# Altium schematic sheet tia2.SchDoc: TIA 2
size A4; Author: Peilin Perry Xu; CompanyName: N/A; DrawnBy: Peilin Perry Xu; Engineer: Peilin Perry Xu; Organization: N/A; Address1: 89 Chestnut Street, Toronto, ON, Canada; Address2: 79 Brass Drive, Richmond Hill, ON, Canada; DocumentNumber: 2.2; Revision: 1; SheetNumber: 4; SheetTotal: 11
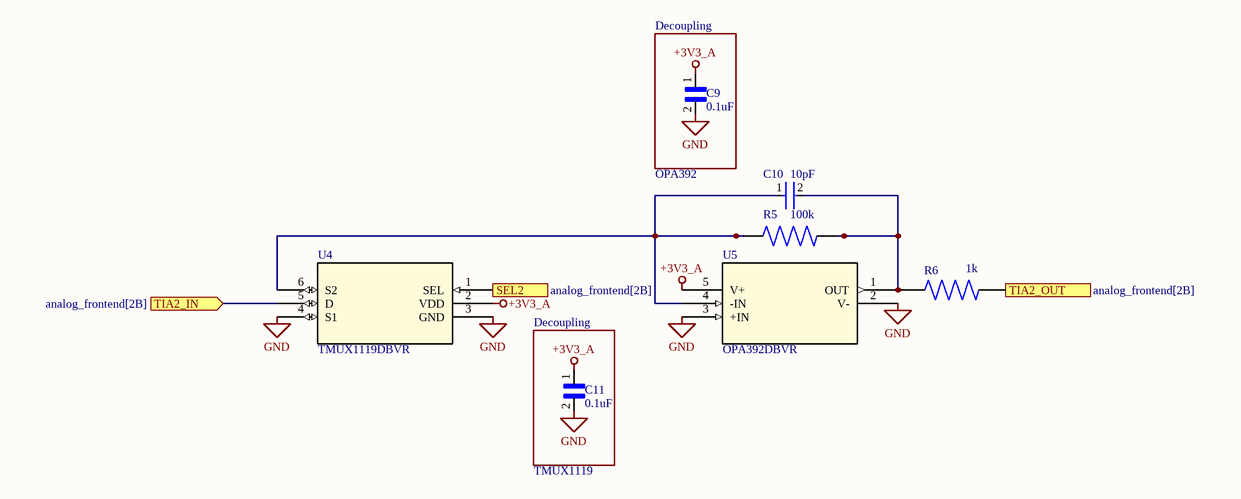
[diagram p0: tia2.SchDoc]

## Parts
C9  0.1uF  [CC0603JRX7R8BB104]
C10  10pF  [GCM1885C2A100JA16D]
C11  0.1uF  [CC0603JRX7R8BB104]
R5  100k  [RESC2012X55N]
R6  1k  [RESC1508X55N]
U4  TMUX1119DBVR  [TMUX1119DBVR]
U5  OPA392DBVR  [OPA392DBVR]

## Blocks framed on the sheet
Decoupling: C9
Decoupling: C11

## Ports
SEL2 (in, see analog_frontend[2B]), TIA2_IN (in, see analog_frontend[2B]), TIA2_OUT (out, see analog_frontend[2B])

## Nets
+3V3_A: C9.1 C11.1 U4.2(VDD) U5.5(V+)
GND: C9.2 C11.2 U4.3(GND) U4.4(S1) U5.2(V-) U5.3(+IN)
SEL2: U4.1(SEL) ; port SEL2
TIA2_IN: U4.5(D) ; port TIA2_IN
TIA2_OUT: R6.2 ; port TIA2_OUT
NetC10_1: C10.1 R5.1 U4.6(S2) U5.4(-IN)
NetC10_2: C10.2 R5.2 R6.1 U5.1(OUT)

## Notes on the sheet
- OPA392
- TMUX1119

## Library data of the parts
C9 C11 = CC0603JRX7R8BB104: 25V 100nF X7R ±5% 0603 Multilayer Ceramic Capacitors MLCC - SMD/SMT ROHS; Manufacturer: Yageo Group; Supplier: DigiKey; Supplier Part Number: 311-1777-1-ND; Manufacturer Part Number: CC0603JRX7R8BB104; RoHS: Compliant; Category: Ceramic Capacitors; Stock: 156739; Pricing: 1=0.1, 10=0.056, 50=0.0386, 100=0.0333, 500=0.02444, 1000=0.02172 (USD); Value: 100nF; Case/Package: 0603; Case Code (Imperial): 0603; Case Code (Metric): 1608; China RoHS: Compliant; Composition: Ceramic; Depth: 800µm; Dielectric: X7R; Dielectric Material: Ceramic; Halogen Free: Halogen Free; Height: 800µm; Lead Free: Lead Free; Length: 1.6mm; Lifecycle Status: Production; Max Operating Temperature: 125°C; Min Operating Temperature: -55°C; Mounting Technology: Surface Mount; Number of Terminals: 2; Radiation Hardening: No; REACH SVHC: Yes; Schedule B: 8532240020, 8532240020|8532240020, 8532240020|8532240020|8532240020, 8532240020|8532240020|8532240020|8532240020; Termination: SMD/SMT; Thickness: 889µm; Tolerance: 5%; Voltage Rating: 25V; Voltage Rating (DC): 25V; Weight: 2.012816mg; Width: 800µm; ComponentLink1URL: https://datasheet.octopart.com:443/CC0603JRX7R8BB104-Yageo-datasheet-177165144.pdf?src-supplier=IHS; ComponentLink1Description: https://datasheet.octopart.com:443/CC0603JRX7R8BB104-Yageo-datasheet-177165144.pdf?src-supplier=IHS; ComponentLink2URL: https://datasheet.octopart.com:443/CC0603JRX7R8BB104-Yageo-datasheet-147453679.pdf?src-supplier=Farnell; ComponentLink2Description: https://datasheet.octopart.com:443/CC0603JRX7R8BB104-Yageo-datasheet-147453679.pdf?src-supplier=Farnell; ComponentLink3URL: https://datasheet.octopart.com:443/CC0603JRX7R8BB104-Yageo-datasheet-181968346.pdf?src-supplier=Farnell; ComponentLink3Description: https://datasheet.octopart.com:443/CC0603JRX7R8BB104-Yageo-datasheet-181968346.pdf?src-supplier=Farnell; ComponentLink4URL: https://datasheet.octopart.com:443/CC0603JRX7R8BB104-Yageo-datasheet-151948686.pdf?src-supplier=TME; ComponentLink4Description: https://datasheet.octopart.com:443/CC0603JRX7R8BB104-Yageo-datasheet-151948686.pdf?src-supplier=TME; ComponentLink5URL: https://datasheet.octopart.com/CC0603JRX7R8BB104-Yageo-datasheet-12526321.pdf; ComponentLink5Description: https://datasheet.octopart.com/CC0603JRX7R8BB104-Yageo-datasheet-12526321.pdf; ComponentLink6URL: https://datasheet.octopart.com/CC0603JRX7R8BB104-Yageo-datasheet-10883670.pdf; ComponentLink6Description: https://datasheet.octopart.com/CC0603JRX7R8BB104-Yageo-datasheet-10883670.pdf; ComponentLink7URL: https://datasheet.octopart.com:443/CC0603JRX7R8BB104-Yageo-datasheet-166511530.pdf?src-supplier=Future+Electronics; ComponentLink7Description: https://datasheet.octopart.com:443/CC0603JRX7R8BB104-Yageo-datasheet-166511530.pdf?src-supplier=Future+Electronics; ComponentLink8URL: https://datasheet.octopart.com:443/CC0603JRX7R8BB104-Yageo-datasheet-137700082.pdf?src-supplier=Future+Electronics; ComponentLink8Description: https://datasheet.octopart.com:443/CC0603JRX7R8BB104-Yageo-datasheet-137700082.pdf?src-supplier=Future+Electronics; ComponentLink9URL: https://datasheet.octopart.com:443/CC0603JRX7R8BB104-Yageo-datasheet-137700084.pdf?src-supplier=Future+Electronics; ComponentLink9Description: https://datasheet.octopart.com:443/CC0603JRX7R8BB104-Yageo-datasheet-137700084.pdf?src-supplier=Future+Electronics; ComponentLink10URL: https://datasheet.octopart.com:443/CC0603JRX7R8BB104-Yageo-datasheet-27626582.pdf?src-supplier=Future+Electronics; ComponentLink10Description: https://datasheet.octopart.com:443/CC0603JRX7R8BB104-Yageo-datasheet-27626582.pdf?src-supplier=Future+Electronics; ComponentLink11URL: https://datasheet.octopart.com:443/CC0603JRX7R8BB104-Yageo-datasheet-15895757.pdf?src-supplier=Future+Electronics; ComponentLink11Description: https://datasheet.octopart.com:443/CC0603JRX7R8BB104-Yageo-datasheet-15895757.pdf?src-supplier=Future+Electronics; ComponentLink12URL: https://datasheet.octopart.com:443/CC0603JRX7R8BB104-Yageo-datasheet-10911834.pdf?src-supplier=Future+Electronics; ComponentLink12Description: https://datasheet.octopart.com:443/CC0603JRX7R8BB104-Yageo-datasheet-10911834.pdf?src-supplier=Future+Electronics; ComponentLink13URL: https://datasheet.octopart.com:443/CC0603JRX7R8BB104-Yageo-datasheet-8324442.pdf?src-supplier=Future+Electronics; ComponentLink13Description: https://datasheet.octopart.com:443/CC0603JRX7R8BB104-Yageo-datasheet-8324442.pdf?src-supplier=Future+Electronics; ComponentLink14URL: https://datasheet.octopart.com:443/CC0603JRX7R8BB104-Yageo-Group-datasheet-165992755.pdf?src-supplier=ODG+(Origin+Data+Global); ComponentLink14Description: https://datasheet.octopart.com:443/CC0603JRX7R8BB104-Yageo-Group-datasheet-165992755.pdf?src-supplier=ODG+(Origin+Data+Global); ComponentLink15URL: http://sigma.octopart.com:80/rohs_statement/Surface-Mount-Ceramic-Multilayer-Capacitors%3B-General-Purpose-%26-High-Capacitance-Class-2%2C-X7R-Yageo-family-124.pdf?src-supplier=Compliance+Statements; ComponentLink15Description: http://sigma.octopart.com:80/rohs_statement/Surface-Mount-Ceramic-Multilayer-Capacitors%3B-General-Purpose-%26-High-Capacitance-Class-2%2C-X7R-Yageo-family-124.pdf?src-supplier=Compliance+Statements; ComponentLink16URL: http://sigma.octopart.com:80/reach_statement/Surface-Mount-Ceramic-Multilayer-Capacitors%3B-General-Purpose-%26-High-Capacitance-Class-2%2C-X7R-Yageo-family-125.pdf?src-supplier=Compliance+Statements; ComponentLink16Description: http://sigma.octopart.com:80/reach_statement/Surface-Mount-Ceramic-Multilayer-Capacitors%3B-General-Purpose-%26-High-Capacitance-Class-2%2C-X7R-Yageo-family-125.pdf?src-supplier=Compliance+Statements; ComponentLink17URL: http://sigma.octopart.com:80/conflict_mineral_statement/Yageo-company-3.pdf?src-supplier=Compliance+Statements; ComponentLink17Description: http://sigma.octopart.com:80/conflict_mineral_statement/Yageo-company-3.pdf?src-supplier=Compliance+Statements; ComponentLink18URL: http://sigma.octopart.com:80/rohs_statement/Yageo-company-2.pdf?src-supplier=Compliance+Statements; ComponentLink18Description: http://sigma.octopart.com:80/rohs_statement/Yageo-company-2.pdf?src-supplier=Compliance+Statements; Supplier 1: DigiKey; Supplier Part Number 1: 311-1777-1-ND
C10 = GCM1885C2A100JA16D: 100V 10pF C0G ±5% 0603 Multilayer Ceramic Capacitors MLCC - SMD/SMT ROHS; Manufacturer: Murata; Manufacturer Lifecycle Status: IN PRODUCTION; Temperature Coefficient: 30ppm/°C; Supplier: DigiKey; Supplier Part Number: 490-4770-1-ND; Manufacturer Part Number: GCM1885C2A100JA16D; RoHS: Compliant; Category: Ceramic Capacitors; Stock: 71457; Pricing: 1=0.11, 10=0.059, 50=0.041, 100=0.0355, 500=0.02614, 1000=0.02328 (USD); Value: 10pF; Case/Package: 0603; Case Code (Imperial): 0603; Case Code (Metric): 1608; Depth: 800µm; Dielectric: C0G; Dielectric Material: Ceramic; Height: 800µm; Lead Free: Lead Free; Length: 1.6mm; Lifecycle Status: Production; Material: Ceramic; Max Operating Temperature: 125°C; Min Operating Temperature: -55°C; Mounting Technology: Surface Mount; Number of Terminals: 2; Radiation Hardening: No; Ratings: AEC-Q200; REACH SVHC: Yes; Schedule B: 8532240020, 8532240020|8532240020, 8532240020|8532240020|8532240020, 8532240020|8532240020|8532240020|8532240020; Termination: SMD/SMT; Tolerance: 5%; Voltage Rating: 100V; Voltage Rating (DC): 100V; Width: 800µm; ComponentLink1URL: https://datasheet.octopart.com:443/GCM1885C2A100JA16D-Murata-datasheet-149522596.pdf?src-supplier=element14+APAC; ComponentLink1Description: https://datasheet.octopart.com:443/GCM1885C2A100JA16D-Murata-datasheet-149522596.pdf?src-supplier=element14+APAC; ComponentLink2URL: https://datasheet.octopart.com:443/GCM1885C2A100JA16D-Murata-datasheet-141266547.pdf?src-supplier=Geoflip; ComponentLink2Description: https://datasheet.octopart.com:443/GCM1885C2A100JA16D-Murata-datasheet-141266547.pdf?src-supplier=Geoflip; ComponentLink3URL: https://datasheet.octopart.com:443/GCM1885C2A100JA16D-Murata-datasheet-14404396.pdf?src-supplier=Future+Electronics; ComponentLink3Description: https://datasheet.octopart.com:443/GCM1885C2A100JA16D-Murata-datasheet-14404396.pdf?src-supplier=Future+Electronics; ComponentLink4URL: https://datasheet.octopart.com:443/GCM1885C2A100JA16D-Murata-datasheet-44104434.pdf?src-supplier=Future+Electronics; ComponentLink4Description: https://datasheet.octopart.com:443/GCM1885C2A100JA16D-Murata-datasheet-44104434.pdf?src-supplier=Future+Electronics; ComponentLink5URL: https://datasheet.octopart.com:443/GCM1885C2A100JA16D-Murata-datasheet-140657391.pdf?src-supplier=Ciiva; ComponentLink5Description: https://datasheet.octopart.com:443/GCM1885C2A100JA16D-Murata-datasheet-140657391.pdf?src-supplier=Ciiva; ComponentLink6URL: https://datasheet.octopart.com:443/GCM1885C2A100JA16D-Murata-datasheet-138717048.pdf?src-supplier=Ciiva; ComponentLink6Description: https://datasheet.octopart.com:443/GCM1885C2A100JA16D-Murata-datasheet-138717048.pdf?src-supplier=Ciiva; ComponentLink7URL: https://datasheet.octopart.com:443/GCM1885C2A100JA16D-Murata-datasheet-150009059.pdf?src-supplier=Arrow.cn; ComponentLink7Description: https://datasheet.octopart.com:443/GCM1885C2A100JA16D-Murata-datasheet-150009059.pdf?src-supplier=Arrow.cn; ComponentLink8URL: https://datasheet.octopart.com:443/GCM1885C2A100JA16D-Murata-datasheet-11892650.pdf?src-supplier=Arrow+Electronics; ComponentLink8Description: https://datasheet.octopart.com:443/GCM1885C2A100JA16D-Murata-datasheet-11892650.pdf?src-supplier=Arrow+Electronics; ComponentLink9URL: https://datasheet.octopart.com:443/GCM1885C2A100JA16D-Murata-datasheet-12511495.pdf?src-supplier=TME; ComponentLink9Description: https://datasheet.octopart.com:443/GCM1885C2A100JA16D-Murata-datasheet-12511495.pdf?src-supplier=TME; ComponentLink10URL: http://sigma.octopart.com:80/reach_statement/Murata-company-16.pdf?src-supplier=Compliance+Statements; ComponentLink10Description: http://sigma.octopart.com:80/reach_statement/Murata-company-16.pdf?src-supplier=Compliance+Statements; Supplier 1: DigiKey; Supplier Part Number 1: 490-4770-1-ND
R5 = TNPW0805100KBXEN: Fixed Resistor, Thin Film, 0.125W, 100000ohm, 150V, 0.1% +/-Tol, 15ppm/Cel, Surface Mount, 0805; Manufacturer: Vishay; Power Dissipation: 125mW; Value: 100kΩ; Temperature Coefficient: 15ppm/°C; Supplier: DigiKey; Supplier Part Number: 541-1729-1-ND; Manufacturer Part Number: TNPW0805100KBXEN; RoHS: Compliant; Category: Chip SMD Resistors; Stock: 958; Pricing: 1=0.56, 10=0.462, 25=0.4284, 50=0.4048, 100=0.383, 250=0.35688, 500=0.33922 (USD); Case/Package: 0805; Case Code (Imperial): 0805; Case Code (Metric): 2012; China RoHS: Compliant; Composition: Thin Film; Depth: 1.25mm; Height: 450µm; Length: 2.0066mm; Lifecycle Status: Production; Max Operating Temperature: 125°C; Military Standard: Not; Min Operating Temperature: -55°C; Mounting Technology: Surface Mount; Number of Terminals: 2; Packaging: Digi-Reel®; Power Rating: 125mW; REACH SVHC: Yes; Schedule B: 8533210045, 8533210045|8533210045|8533210045|8533210045|8533210045; Tolerance: 0.1%; Width: 1.25mm; Working Voltage: 150V; ComponentLink1URL: https://datasheet.octopart.com:443/TNPW0805100KBXEN-Vishay-datasheet-170520403.pdf?src-supplier=IHS; ComponentLink1Description: https://datasheet.octopart.com:443/TNPW0805100KBXEN-Vishay-datasheet-170520403.pdf?src-supplier=IHS; ComponentLink2URL: https://datasheet.octopart.com:443/TNPW0805100KBXEN-Vishay-Dale-datasheet-182026744.pdf?src-supplier=IHS; ComponentLink2Description: https://datasheet.octopart.com:443/TNPW0805100KBXEN-Vishay-Dale-datasheet-182026744.pdf?src-supplier=IHS; ComponentLink3URL: https://datasheet.octopart.com/TNPW0805100KBXEN-Vishay-datasheet-13498837.pdf; ComponentLink3Description: https://datasheet.octopart.com/TNPW0805100KBXEN-Vishay-datasheet-13498837.pdf; ComponentLink4URL: https://datasheet.octopart.com/TNPW0805100KBXEN-Vishay-datasheet-13414878.pdf; ComponentLink4Description: https://datasheet.octopart.com/TNPW0805100KBXEN-Vishay-datasheet-13414878.pdf; ComponentLink5URL: https://datasheet.octopart.com/TNPW0805100KBXEN-Vishay-datasheet-13295955.pdf; ComponentLink5Description: https://datasheet.octopart.com/TNPW0805100KBXEN-Vishay-datasheet-13295955.pdf; ComponentLink6URL: https://datasheet.octopart.com/TNPW0805100KBXEN-Vishay-datasheet-13196373.pdf; ComponentLink6Description: https://datasheet.octopart.com/TNPW0805100KBXEN-Vishay-datasheet-13196373.pdf; ComponentLink7URL: https://datasheet.octopart.com/TNPW0805100KBXEN-Vishay-datasheet-13143890.pdf; ComponentLink7Description: https://datasheet.octopart.com/TNPW0805100KBXEN-Vishay-datasheet-13143890.pdf; ComponentLink8URL: https://datasheet.octopart.com/TNPW0805100KBXEN-Vishay-datasheet-13081780.pdf; ComponentLink8Description: https://datasheet.octopart.com/TNPW0805100KBXEN-Vishay-datasheet-13081780.pdf; ComponentLink9URL: https://datasheet.octopart.com/TNPW0805100KBXEN-Vishay-datasheet-13052401.pdf; ComponentLink9Description: https://datasheet.octopart.com/TNPW0805100KBXEN-Vishay-datasheet-13052401.pdf; ComponentLink10URL: https://datasheet.octopart.com/TNPW0805100KBXEN-Vishay-datasheet-13034137.pdf; ComponentLink10Description: https://datasheet.octopart.com/TNPW0805100KBXEN-Vishay-datasheet-13034137.pdf; ComponentLink11URL: https://datasheet.octopart.com/TNPW0805100KBXEN-Vishay-datasheet-12585086.pdf; ComponentLink11Description: https://datasheet.octopart.com/TNPW0805100KBXEN-Vishay-datasheet-12585086.pdf; ComponentLink12URL: https://datasheet.octopart.com/TNPW0805100KBXEN-Vishay-datasheet-12543131.pdf; ComponentLink12Description: https://datasheet.octopart.com/TNPW0805100KBXEN-Vishay-datasheet-12543131.pdf; ComponentLink13URL: https://datasheet.octopart.com/TNPW0805100KBXEN-Vishay-datasheet-12532511.pdf; ComponentLink13Description: https://datasheet.octopart.com/TNPW0805100KBXEN-Vishay-datasheet-12532511.pdf; ComponentLink14URL: https://datasheet.octopart.com/TNPW0805100KBXEN-Vishay-datasheet-12519971.pdf; ComponentLink14Description: https://datasheet.octopart.com/TNPW0805100KBXEN-Vishay-datasheet-12519971.pdf; ComponentLink15URL: https://datasheet.octopart.com/TNPW0805100KBXEN-Vishay-datasheet-12509767.pdf; ComponentLink15Description: https://datasheet.octopart.com/TNPW0805100KBXEN-Vishay-datasheet-12509767.pdf; ComponentLink16URL: https://datasheet.octopart.com/TNPW0805100KBXEN-Vishay-datasheet-12365287.pdf; ComponentLink16Description: https://datasheet.octopart.com/TNPW0805100KBXEN-Vishay-datasheet-12365287.pdf; ComponentLink17URL: https://datasheet.octopart.com/TNPW0805100KBXEN-Vishay-datasheet-10854096.pdf; ComponentLink17Description: https://datasheet.octopart.com/TNPW0805100KBXEN-Vishay-datasheet-10854096.pdf; ComponentLink18URL: https://datasheet.octopart.com/TNPW0805100KBXEN-Vishay-datasheet-10678752.pdf; ComponentLink18Description: https://datasheet.octopart.com/TNPW0805100KBXEN-Vishay-datasheet-10678752.pdf; ComponentLink19URL: https://datasheet.octopart.com/TNPW0805100KBXEN-Vishay-datasheet-10283461.pdf; ComponentLink19Description: https://datasheet.octopart.com/TNPW0805100KBXEN-Vishay-datasheet-10283461.pdf; ComponentLink20URL: https://datasheet.octopart.com/TNPW0805100KBXEN-Vishay-datasheet-10185418.pdf; ComponentLink20Description: https://datasheet.octopart.com/TNPW0805100KBXEN-Vishay-datasheet-10185418.pdf; ComponentLink21URL: https://datasheet.octopart.com/TNPW0805100KBXEN-Vishay-datasheet-10055244.pdf; ComponentLink21Description: https://datasheet.octopart.com/TNPW0805100KBXEN-Vishay-datasheet-10055244.pdf; ComponentLink22URL: http://sigma.octopart.com:80/rohs_statement/Vishay-company-15.pdf?src-supplier=Compliance+Statements; ComponentLink22Description: http://sigma.octopart.com:80/rohs_statement/Vishay-company-15.pdf?src-supplier=Compliance+Statements; Supplier 1: DigiKey; Supplier Part Number 1: 541-1729-1-ND; Export Control Classification Number (ECCN) Code: EAR99; Harmonized Tariff Schedule (HTS) Code: 8533.21.00.30; Number of Terminations: 2; Contact Plating: Tin; Features: Anti-Sulfur, Automotive AEC-Q200, Moisture Resistant; Max Power Dissipation: 125mW; Radiation Hardening: No
R6 = TNPW06031K00BXEN: Fixed Resistor, Thin Film, 0.1W, 1000ohm, 75V, 0.1% +/-Tol, 15ppm/Cel, Surface Mount, 0603; Manufacturer: Vishay; Max Power Dissipation: 100mW; Value: 1kΩ; Temperature Coefficient: 15ppm/°C; Supplier: DigiKey; Supplier Part Number: 541-1724-1-ND; Manufacturer Part Number: TNPW06031K00BXEN; RoHS: Compliant; Category: Chip SMD Resistors; Stock: 1829; Pricing: 1=0.66, 10=0.548, 25=0.5076, 50=0.4798, 100=0.454, 250=0.42332, 500=0.40256 (USD); Case/Package: 0603; Case Code (Imperial): 0603; Case Code (Metric): 1608; China RoHS: Compliant; Composition: Thin Film; Contact Plating: Tin; Country of Origin: Germany, Israel; Depth: 850µm; Export Control Classification Number (ECCN) Code: EAR99; Features: Anti-Sulfur, Automotive AEC-Q200, Moisture Resistant; Height: 450µm; Harmonized Tariff Schedule (HTS) Code: 8533.21.00.30; Introduction Date: 2008-07-30; Length: 1.6002mm; Lifecycle Status: Production; Max Operating Temperature: 125°C; Military Standard: Not; Min Operating Temperature: -55°C; Mounting Technology: Surface Mount; Number of Terminals: 2; Number of Terminations: 2; Packaging: Digi-Reel®; Power Dissipation: 100mW; Power Rating: 100mW; Radiation Hardening: No; REACH SVHC: Yes; Schedule B: 8533210045, 8533210045|8533210045|8533210045|8533210045|8533210045|8533210045|8533210045|8533210045|8533210045|8533210045|8533210045|8533210045|8533210045|8533210045|8533210045|8533210045|8533210045|8533210045|8533210045|8533210045|8533210045|8533210045|8533210045|85; Tolerance: 0.1%; Width: 850µm; Working Voltage: 75V; ComponentLink1URL: https://datasheet.octopart.com:443/TNPW06031K00BXEN-Vishay-datasheet-170520403.pdf?src-supplier=IHS; ComponentLink1Description: https://datasheet.octopart.com:443/TNPW06031K00BXEN-Vishay-datasheet-170520403.pdf?src-supplier=IHS; ComponentLink2URL: https://datasheet.octopart.com:443/TNPW06031K00BXEN-Vishay-Dale-datasheet-182026744.pdf?src-supplier=IHS; ComponentLink2Description: https://datasheet.octopart.com:443/TNPW06031K00BXEN-Vishay-Dale-datasheet-182026744.pdf?src-supplier=IHS; ComponentLink3URL: https://datasheet.octopart.com:443/TNPW06031K00BXEN-Vishay-datasheet-79783896.pdf?src-supplier=Future+Electronics; ComponentLink3Description: https://datasheet.octopart.com:443/TNPW06031K00BXEN-Vishay-datasheet-79783896.pdf?src-supplier=Future+Electronics; ComponentLink4URL: https://datasheet.octopart.com/TNPW06031K00BXEN-Vishay-datasheet-13498837.pdf; ComponentLink4Description: https://datasheet.octopart.com/TNPW06031K00BXEN-Vishay-datasheet-13498837.pdf; ComponentLink5URL: https://datasheet.octopart.com/TNPW06031K00BXEN-Vishay-datasheet-13414878.pdf; ComponentLink5Description: https://datasheet.octopart.com/TNPW06031K00BXEN-Vishay-datasheet-13414878.pdf; ComponentLink6URL: https://datasheet.octopart.com/TNPW06031K00BXEN-Vishay-datasheet-13295955.pdf; ComponentLink6Description: https://datasheet.octopart.com/TNPW06031K00BXEN-Vishay-datasheet-13295955.pdf; ComponentLink7URL: https://datasheet.octopart.com/TNPW06031K00BXEN-Vishay-datasheet-13196373.pdf; ComponentLink7Description: https://datasheet.octopart.com/TNPW06031K00BXEN-Vishay-datasheet-13196373.pdf; ComponentLink8URL: https://datasheet.octopart.com/TNPW06031K00BXEN-Vishay-datasheet-13143890.pdf; ComponentLink8Description: https://datasheet.octopart.com/TNPW06031K00BXEN-Vishay-datasheet-13143890.pdf; ComponentLink9URL: https://datasheet.octopart.com/TNPW06031K00BXEN-Vishay-datasheet-13081780.pdf; ComponentLink9Description: https://datasheet.octopart.com/TNPW06031K00BXEN-Vishay-datasheet-13081780.pdf; ComponentLink10URL: https://datasheet.octopart.com/TNPW06031K00BXEN-Vishay-datasheet-13052401.pdf; ComponentLink10Description: https://datasheet.octopart.com/TNPW06031K00BXEN-Vishay-datasheet-13052401.pdf; ComponentLink11URL: https://datasheet.octopart.com/TNPW06031K00BXEN-Vishay-datasheet-13034137.pdf; ComponentLink11Description: https://datasheet.octopart.com/TNPW06031K00BXEN-Vishay-datasheet-13034137.pdf; ComponentLink12URL: https://datasheet.octopart.com/TNPW06031K00BXEN-Vishay-datasheet-12585086.pdf; ComponentLink12Description: https://datasheet.octopart.com/TNPW06031K00BXEN-Vishay-datasheet-12585086.pdf; ComponentLink13URL: https://datasheet.octopart.com/TNPW06031K00BXEN-Vishay-datasheet-12543131.pdf; ComponentLink13Description: https://datasheet.octopart.com/TNPW06031K00BXEN-Vishay-datasheet-12543131.pdf; ComponentLink14URL: https://datasheet.octopart.com/TNPW06031K00BXEN-Vishay-datasheet-12532511.pdf; ComponentLink14Description: https://datasheet.octopart.com/TNPW06031K00BXEN-Vishay-datasheet-12532511.pdf; ComponentLink15URL: https://datasheet.octopart.com/TNPW06031K00BXEN-Vishay-datasheet-12519971.pdf; ComponentLink15Description: https://datasheet.octopart.com/TNPW06031K00BXEN-Vishay-datasheet-12519971.pdf; ComponentLink16URL: https://datasheet.octopart.com/TNPW06031K00BXEN-Vishay-datasheet-12509767.pdf; ComponentLink16Description: https://datasheet.octopart.com/TNPW06031K00BXEN-Vishay-datasheet-12509767.pdf; ComponentLink17URL: https://datasheet.octopart.com/TNPW06031K00BXEN-Vishay-datasheet-12365287.pdf; ComponentLink17Description: https://datasheet.octopart.com/TNPW06031K00BXEN-Vishay-datasheet-12365287.pdf; ComponentLink18URL: https://datasheet.octopart.com/TNPW06031K00BXEN-Vishay-datasheet-10854096.pdf; ComponentLink18Description: https://datasheet.octopart.com/TNPW06031K00BXEN-Vishay-datasheet-10854096.pdf; ComponentLink19URL: https://datasheet.octopart.com/TNPW06031K00BXEN-Vishay-datasheet-10678752.pdf; ComponentLink19Description: https://datasheet.octopart.com/TNPW06031K00BXEN-Vishay-datasheet-10678752.pdf; ComponentLink20URL: https://datasheet.octopart.com/TNPW06031K00BXEN-Vishay-datasheet-10283461.pdf; ComponentLink20Description: https://datasheet.octopart.com/TNPW06031K00BXEN-Vishay-datasheet-10283461.pdf; ComponentLink21URL: https://datasheet.octopart.com/TNPW06031K00BXEN-Vishay-datasheet-10185418.pdf; ComponentLink21Description: https://datasheet.octopart.com/TNPW06031K00BXEN-Vishay-datasheet-10185418.pdf; ComponentLink22URL: https://datasheet.octopart.com/TNPW06031K00BXEN-Vishay-datasheet-10055244.pdf; ComponentLink22Description: https://datasheet.octopart.com/TNPW06031K00BXEN-Vishay-datasheet-10055244.pdf; ComponentLink23URL: http://sigma.octopart.com:80/rohs_statement/Vishay-company-15.pdf?src-supplier=Compliance+Statements; ComponentLink23Description: http://sigma.octopart.com:80/rohs_statement/Vishay-company-15.pdf?src-supplier=Compliance+Statements; Supplier 1: DigiKey; Supplier Part Number 1: 541-1724-1-ND
U4 = TMUX1119DBVR: 3-pA on-state leakage current, 5-V, 2: 1 (SPDT), 1-channel precision multiplexer 6-SOT-23 -40 to 125; Manufacturer: Texas Instruments; Manufacturer Lifecycle Status: ACTIVE; Supplier: DigiKey; Supplier Part Number: 296-TMUX1119DBVRCT-ND; Manufacturer Part Number: TMUX1119DBVR; RoHS: Compliant; Category: Analog Switches and Multiplexers; Stock: 2894; Pricing: 1=2.28, 10=1.689, 25=1.5416, 100=1.3792, 250=1.30176, 500=1.2551, 1000=1.2167 (USD); Case/Package: SOT-23; Height: 0m; Length: 2.9mm; Lifecycle Status: Production; Pins: 6; Thickness: 1.2mm; Width: 1.6mm; ComponentLink1URL: https://sigma.octopart.com:443/182282880/technical_drawing/Texas-Instruments-TMUX1119DBVR.pdf?src-supplier=Texas+Instruments; ComponentLink1Description: https://sigma.octopart.com:443/182282880/technical_drawing/Texas-Instruments-TMUX1119DBVR.pdf?src-supplier=Texas+Instruments; ComponentLink2URL: https://octopart.com:443/opatz8j6/c1?t=yECAgEkYw3IrtmcYAPUg6qmtTNVur26oqu7bOUHrX4PjdCuRILzYU7NYBAOQhcHCEh7pGXbbhV7dRzS-y_krheoFYbJWFRUJnbuv9i6p_6F7rsSszCR-29LbgFxprD0A_1YADurANESAiN07S0sT7RtN2jCeaOp3CvIUB0Bo5PdEeow8fbFIgGzo96oF51yr-ojeUHaJ1WufcKjvz0ps8WKzjIL6purfuRAG7xH0VGn1P7ZxlGQD0tIKLS8oKKYj-Fz5Ea2n9r1HKmhlaJ4GaZS8DSK0gFGX7s4AbnVilZHcfV3fVg9sV4wtLmOQXeutcERFFUScrNyKsjhbrfqGSuNTPgKcDcwJj1v-ecbxAxlVkBgbaKyAS0oepKB46l8Mr7K_1Qkg&src-supplier=Texas+Instruments; ComponentLink2Description: https://octopart.com:443/opatz8j6/c1?t=yECAgEkYw3IrtmcYAPUg6qmtTNVur26oqu7bOUHrX4PjdCuRILzYU7NYBAOQhcHCEh7pGXbbhV7dRzS-y_krheoFYbJWFRUJnbuv9i6p_6F7rsSszCR-29LbgFxprD0A_1YADurANESAiN07S0sT7RtN2jCeaOp3CvIUB0Bo5PdEeow8fbFIgGzo96oF51yr-ojeUHaJ1WufcKjvz0ps8WKzjIL6purfuRAG7xH0VGn1P7ZxlGQD0tIKLS8oKKYj-Fz5Ea2n9r1HKmhlaJ4GaZS8DSK0gFGX7s4AbnVilZHcfV3fVg9sV4wtLmOQXeutcERFFUScrNyKsjhbrfqGSuNTPgKcDcwJj1v-ecbxAxlVkBgbaKyAS0oepKB46l8Mr7K_1Qkg&src-supplier=Texas+Instruments; ComponentLink3URL: https://sigma.octopart.com:443/179253514/technical_drawing/Texas-Instruments-TMUX1119DBVR.pdf?src-supplier=Texas+Instruments; ComponentLink3Description: https://sigma.octopart.com:443/179253514/technical_drawing/Texas-Instruments-TMUX1119DBVR.pdf?src-supplier=Texas+Instruments; ComponentLink4URL: https://sigma.octopart.com:443/177332312/technical_drawing/Texas-Instruments-TMUX1119DBVR.pdf?src-supplier=Texas+Instruments; ComponentLink4Description: https://sigma.octopart.com:443/177332312/technical_drawing/Texas-Instruments-TMUX1119DBVR.pdf?src-supplier=Texas+Instruments; ComponentLink5URL: https://sigma.octopart.com:443/175570407/technical_drawing/Texas-Instruments-TMUX1119DBVR.pdf?src-supplier=Texas+Instruments; ComponentLink5Description: https://sigma.octopart.com:443/175570407/technical_drawing/Texas-Instruments-TMUX1119DBVR.pdf?src-supplier=Texas+Instruments; ComponentLink6URL: https://sigma.octopart.com:443/154719501/technical_drawing/Texas-Instruments-TMUX1119DBVR.pdf?src-supplier=Texas+Instruments; ComponentLink6Description: https://sigma.octopart.com:443/154719501/technical_drawing/Texas-Instruments-TMUX1119DBVR.pdf?src-supplier=Texas+Instruments; ComponentLink7URL: https://sigma.octopart.com:443/49249327/technical_drawing/Texas-Instruments-TMUX1119DBVR.pdf?src-supplier=Texas+Instruments; ComponentLink7Description: https://sigma.octopart.com:443/49249327/technical_drawing/Texas-Instruments-TMUX1119DBVR.pdf?src-supplier=Texas+Instruments; ComponentLink8URL: https://datasheet.octopart.com:443/TMUX1119DBVR-Texas-Instruments-datasheet-179666360.pdf?src-supplier=EBEE; ComponentLink8Description: https://datasheet.octopart.com:443/TMUX1119DBVR-Texas-Instruments-datasheet-179666360.pdf?src-supplier=EBEE; ComponentLink9URL: https://datasheet.octopart.com:443/TMUX1119DBVR-Texas-Instruments-datasheet-164419629.pdf?src-supplier=Augswan; ComponentLink9Description: https://datasheet.octopart.com:443/TMUX1119DBVR-Texas-Instruments-datasheet-164419629.pdf?src-supplier=Augswan; ComponentLink10URL: http://sigma.octopart.com:80/reach_statement/Texas-Instruments-company-64.pdf?src-supplier=Compliance+Statements; ComponentLink10Description: http://sigma.octopart.com:80/reach_statement/Texas-Instruments-company-64.pdf?src-supplier=Compliance+Statements; ComponentLink11URL: http://sigma.octopart.com:80/conflict_mineral_statement/Texas-Instruments-company-63.pdf?src-supplier=Compliance+Statements; ComponentLink11Description: http://sigma.octopart.com:80/conflict_mineral_statement/Texas-Instruments-company-63.pdf?src-supplier=Compliance+Statements; Supplier 1: DigiKey; Supplier Part Number 1: 296-TMUX1119DBVRCT-ND
U5 = OPA392DBVR: Operational Amplifier, 1 Func, 10uV Offset-Max, CMOS, PDSO5; Manufacturer: Texas Instruments; Manufacturer Lifecycle Status: ACTIVE; Number of Channels: 1; Supplier: DigiKey; Supplier Part Number: 296-OPA392DBVRCT-ND; Manufacturer Part Number: OPA392DBVR; RoHS: Compliant; Category: Amplifiers - Op Amps, Buffer, Instrumentation; Stock: 8819; Pricing: 1=2.31, 10=1.711, 25=1.5616, 100=1.3976, 250=1.31936, 500=1.27218, 1000=1.23335 (USD); Case/Package: SOT-23; Height: 1.45mm; Length: 2.9mm; Lifecycle Status: Production; Pins: 5; Thickness: 1.2mm; Width: 1.6mm; ComponentLink1URL: https://sigma.octopart.com:443/177332311/technical_drawing/Texas-Instruments-OPA392DBVR.pdf?src-supplier=Texas+Instruments; ComponentLink1Description: https://sigma.octopart.com:443/177332311/technical_drawing/Texas-Instruments-OPA392DBVR.pdf?src-supplier=Texas+Instruments; ComponentLink2URL: https://octopart.com:443/opatz8j6/c1?t=2psdxfNSZafVxdZ5ZNOl_DMkcfXgAtcE5XO0nlhC9-kLTH0c2kP_E6ruHRV4RGEK38csRC_DYUSTnen_0j9aC9POSpKpd2mOmgIqO1TNZiXP5ogQozriVbhzqyHbfblWK9OPstIRr3cIrP4FTJ3WcbJ8ET0v1-Z7kljowUcj_5K4IJqpraLjHJ5d995DU-lA3G2MPIFIXdaph2QRYft4ozPdd11jQDbsfTgRIyz7ERvETa37RUgzg66PFoB_swOAjP9cfoHRkuZkn4NuOIfyLPnaU4R5TYlgQQeAViWQJQio1V6w93uzbKeQY1bgaQenG3g0HikSLeAPpnaTmz4osCeyHBYWX4HUltq8GmsHKlpVITfwiReMVGzsZjFepJ_Thh7pRw&src-supplier=Texas+Instruments; ComponentLink2Description: https://octopart.com:443/opatz8j6/c1?t=2psdxfNSZafVxdZ5ZNOl_DMkcfXgAtcE5XO0nlhC9-kLTH0c2kP_E6ruHRV4RGEK38csRC_DYUSTnen_0j9aC9POSpKpd2mOmgIqO1TNZiXP5ogQozriVbhzqyHbfblWK9OPstIRr3cIrP4FTJ3WcbJ8ET0v1-Z7kljowUcj_5K4IJqpraLjHJ5d995DU-lA3G2MPIFIXdaph2QRYft4ozPdd11jQDbsfTgRIyz7ERvETa37RUgzg66PFoB_swOAjP9cfoHRkuZkn4NuOIfyLPnaU4R5TYlgQQeAViWQJQio1V6w93uzbKeQY1bgaQenG3g0HikSLeAPpnaTmz4osCeyHBYWX4HUltq8GmsHKlpVITfwiReMVGzsZjFepJ_Thh7pRw&src-supplier=Texas+Instruments; ComponentLink3URL: https://sigma.octopart.com:443/175570406/technical_drawing/Texas-Instruments-OPA392DBVR.pdf?src-supplier=Texas+Instruments; ComponentLink3Description: https://sigma.octopart.com:443/175570406/technical_drawing/Texas-Instruments-OPA392DBVR.pdf?src-supplier=Texas+Instruments; ComponentLink4URL: https://sigma.octopart.com:443/169406034/technical_drawing/Texas-Instruments-OPA392DBVR.pdf?src-supplier=Texas+Instruments; ComponentLink4Description: https://sigma.octopart.com:443/169406034/technical_drawing/Texas-Instruments-OPA392DBVR.pdf?src-supplier=Texas+Instruments; ComponentLink5URL: https://sigma.octopart.com:443/155939316/technical_drawing/Texas-Instruments-OPA392DBVR.pdf?src-supplier=Texas+Instruments; ComponentLink5Description: https://sigma.octopart.com:443/155939316/technical_drawing/Texas-Instruments-OPA392DBVR.pdf?src-supplier=Texas+Instruments; ComponentLink6URL: https://datasheet.octopart.com:443/OPA392DBVR-Texas-Instruments-datasheet-178481860.pdf?src-supplier=LCSC; ComponentLink6Description: https://datasheet.octopart.com:443/OPA392DBVR-Texas-Instruments-datasheet-178481860.pdf?src-supplier=LCSC; ComponentLink7URL: https://datasheet.octopart.com:443/OPA392DBVR-Texas-Instruments-datasheet-166100503.pdf?src-supplier=Augswan; ComponentLink7Description: https://datasheet.octopart.com:443/OPA392DBVR-Texas-Instruments-datasheet-166100503.pdf?src-supplier=Augswan; ComponentLink8URL: https://datasheet.octopart.com:443/OPA392DBVR-Texas-Instruments-datasheet-165811579.pdf?src-supplier=SHENGYU+ELECTRONICS; ComponentLink8Description: https://datasheet.octopart.com:443/OPA392DBVR-Texas-Instruments-datasheet-165811579.pdf?src-supplier=SHENGYU+ELECTRONICS; ComponentLink9URL: http://sigma.octopart.com:80/reach_statement/Texas-Instruments-company-64.pdf?src-supplier=Compliance+Statements; ComponentLink9Description: http://sigma.octopart.com:80/reach_statement/Texas-Instruments-company-64.pdf?src-supplier=Compliance+Statements; ComponentLink10URL: http://sigma.octopart.com:80/conflict_mineral_statement/Texas-Instruments-company-63.pdf?src-supplier=Compliance+Statements; ComponentLink10Description: http://sigma.octopart.com:80/conflict_mineral_statement/Texas-Instruments-company-63.pdf?src-supplier=Compliance+Statements; Supplier 1: DigiKey; Supplier Part Number 1: 296-OPA392DBVRCT-ND